# EAGLE design wssf_arduino_nano_server (EAGLE 9.6.2)
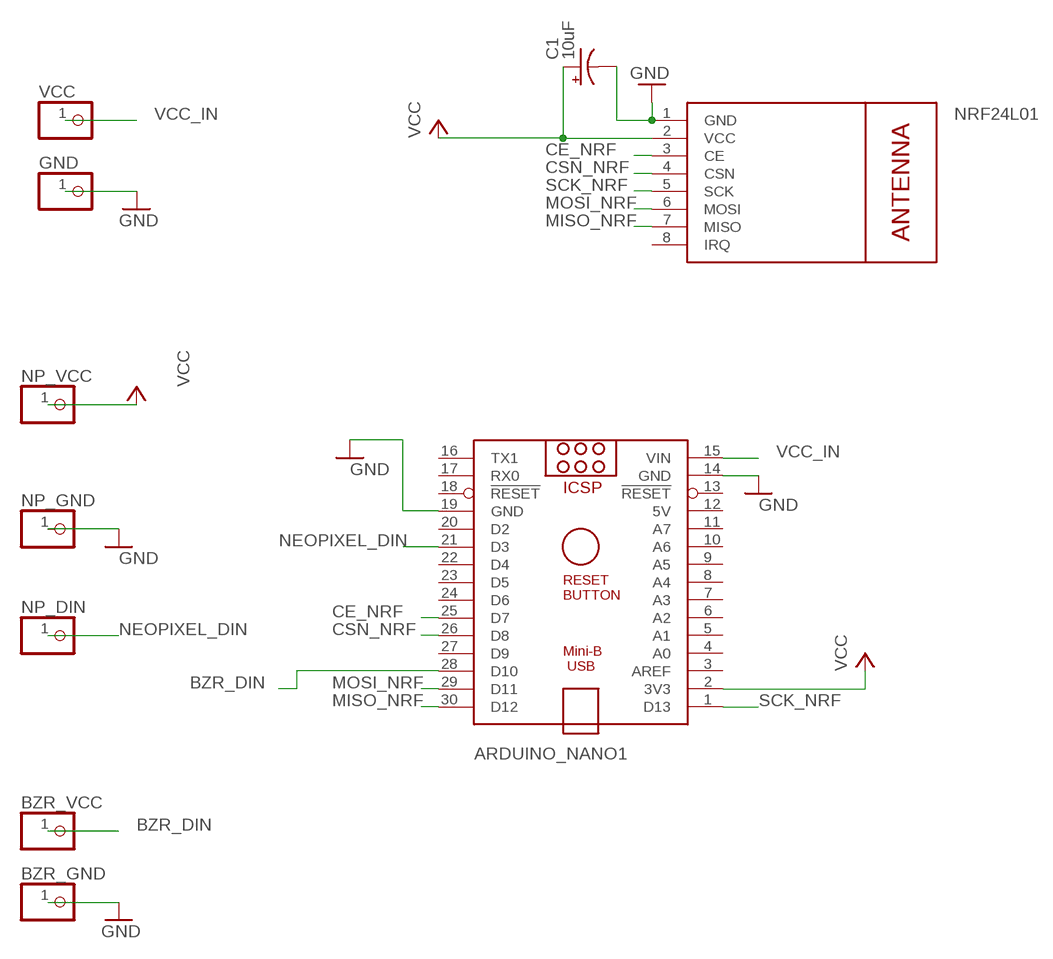
[diagram p0: schematic, sheet 1]

## Parts
ARDUINO_NANO1  ARDUINO_NANO  [ARDUINO_NANO]
BZR_GND  PINHD-1X1  [1X01]
BZR_VCC  PINHD-1X1  [1X01]
C1  10uF  CPOL-USE2-5  [E2-5]
GND  PINHD-1X1  [1X01]
NP_DIN  PINHD-1X1  [1X01]
NP_GND  PINHD-1X1  [1X01]
NP_VCC  PINHD-1X1  [1X01]
NRF24L01  WIRELESS-NRF24L01  [WIRELESS-NRF24L01]
VCC  PINHD-1X1  [1X01]

## Nets
BZR_DIN: ARDUINO_NANO1.28(D10) BZR_VCC.1
CE_NRF: ARDUINO_NANO1.25(D7) NRF24L01.3(CE)
CSN_NRF: ARDUINO_NANO1.26(D8) NRF24L01.4(CSN)
GND: ARDUINO_NANO1.14(GND) ARDUINO_NANO1.19(GND) BZR_GND.1 C1.- GND.1 NP_GND.1 NRF24L01.1(GND)
MISO_NRF: ARDUINO_NANO1.30(D12) NRF24L01.7(MISO)
MOSI_NRF: ARDUINO_NANO1.29(D11) NRF24L01.6(MOSI)
NEOPIXEL_DIN: ARDUINO_NANO1.21(D3) NP_DIN.1
SCK_NRF: ARDUINO_NANO1.1(D13) NRF24L01.5(SCK)
VCC: ARDUINO_NANO1.2(3V3) C1.+ NP_VCC.1 NRF24L01.2(VCC)
VCC_IN: ARDUINO_NANO1.15(VIN) VCC.1
Unconnected: ARDUINO_NANO1.3(AREF) ARDUINO_NANO1.4(A0) ARDUINO_NANO1.5(A1) ARDUINO_NANO1.6(A2) ARDUINO_NANO1.7(A3) ARDUINO_NANO1.8(A4) ARDUINO_NANO1.9(A5) ARDUINO_NANO1.10(A6) ARDUINO_NANO1.11(A7) ARDUINO_NANO1.13(!RESET) ARDUINO_NANO1.16(TX1) ARDUINO_NANO1.17(RX0) ARDUINO_NANO1.18(!RESET) ARDUINO_NANO1.20(D2) ARDUINO_NANO1.22(D4) ARDUINO_NANO1.23(D5) ARDUINO_NANO1.24(D6) ARDUINO_NANO1.27(D9) NRF24L01.8(IRQ)

## Power pins joined to a net without a drawn wire
5V: ARDUINO_NANO1.12(5V)

## Library data of the parts
ARDUINO_NANO1 = ArduinoNanoV30:ARDUINO_NANO: Arduino Nano V3.0 Overview: The Arduino Nano is a small, complete, and breadboard-friendly board based on the ATmega328 (Arduino Nano 3.x) or ATmega168 (Arduino Nano 2.x). It has more or less the same functionality of the Arduino Duemilanove, but in a different package. It lacks only a DC power jack, and works with a Mini-B USB cable instead of a standard one. The Nano was designed and is being produced by Gravitech. Specifications: Microcontroller Atmel ATmega168 or ATmega328 Operating Voltage (logic level) 5 V Input Voltage (recommended) 7-12 V Input Voltage (limits) 6-20 V Digital I/O Pins 14 (of which 6 provide PWM output) Analog Input Pins 8 DC Current per I/O Pin 40 mA Flash Memory 16 KB (ATmega168) or 32 KB (ATmega328) of which 2 KB used by bootloader SRAM 1 KB (ATmega168) or 2 KB (ATmega328) EEPROM 512 bytes (ATmega168) or 1 KB (ATmega328) Clock Speed 16 MHz Dimensions 0.73" x 1.70" Length 45 mm Width 18 mm Weigth 5 g Power: The Arduino Nano can be powered via the Mini-B USB connection, 6-20V unregulated external power supply (pin 30), or 5V regulated external power supply (pin 27). The power source is automatically selected to the highest voltage source. Memory: The ATmega168 has 16 KB of flash memory for storing code (of which 2 KB is used for the bootloader); the ATmega328 has 32 KB, (also with 2 KB used for the bootloader). The ATmega168 has 1 KB of SRAM and 512 bytes of EEPROM (which can be read and written with the EEPROM library); the ATmega328 has 2 KB of SRAM and 1 KB of EEPROM. Input and Output: Each of the 14 digital pins on the Nano can be used as an input or output, using pinMode(), digitalWrite(), and digitalRead() functions. They operate at 5 volts. Each pin can provide or receive a maximum of 40 mA and has an internal pull-up resistor (disconnected by default) of 20-50 kOhms. In addition, some pins have specialized functions. Visit Arduino - ArduinoBoardNano <https://www.arduino.cc/en/Main/ArduinoBoardNano>
BZR_GND BZR_VCC GND NP_DIN NP_GND NP_VCC VCC = pinhead:PINHD-1X1: PIN HEADER
C1 = rcl:CPOL-US: POLARIZED CAPACITOR, American symbol; SPICEPREFIX: C
NRF24L01 = diy-modules:WIRELESS-NRF24L01: 2.4 GHz Wireless Module based on NRF24L01 chip More details available here: http://www.electrodragon.com/w/NRF24L01 Click here to find device on ebay.com <http://www.ebay.com/sch/nrf24l01+arduino>

## Board
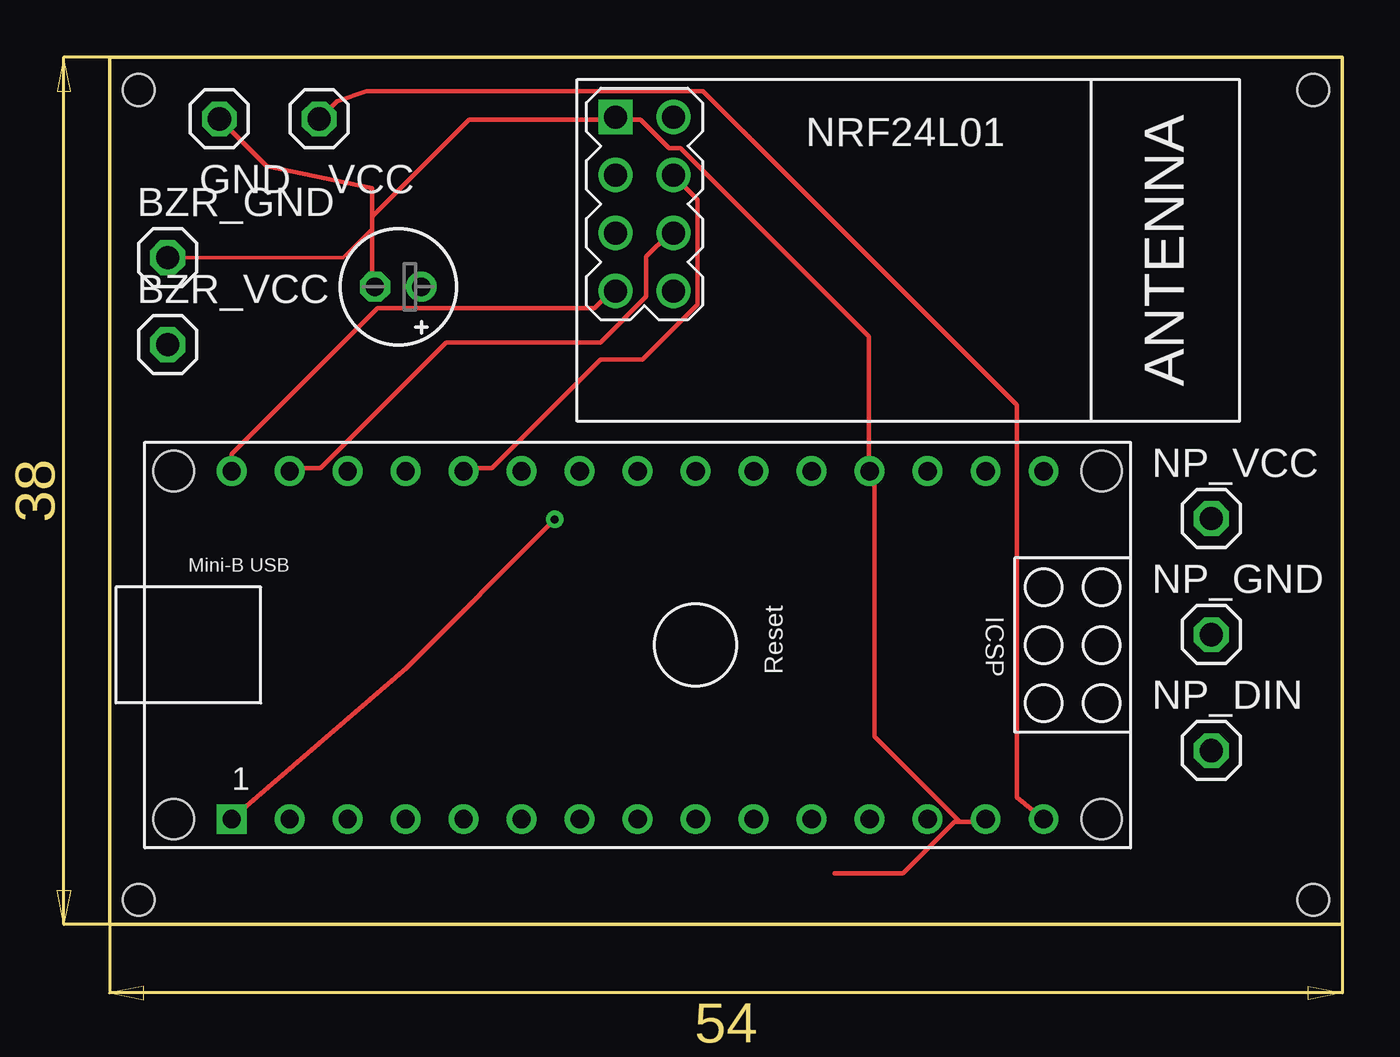
[diagram p1: board, top side]
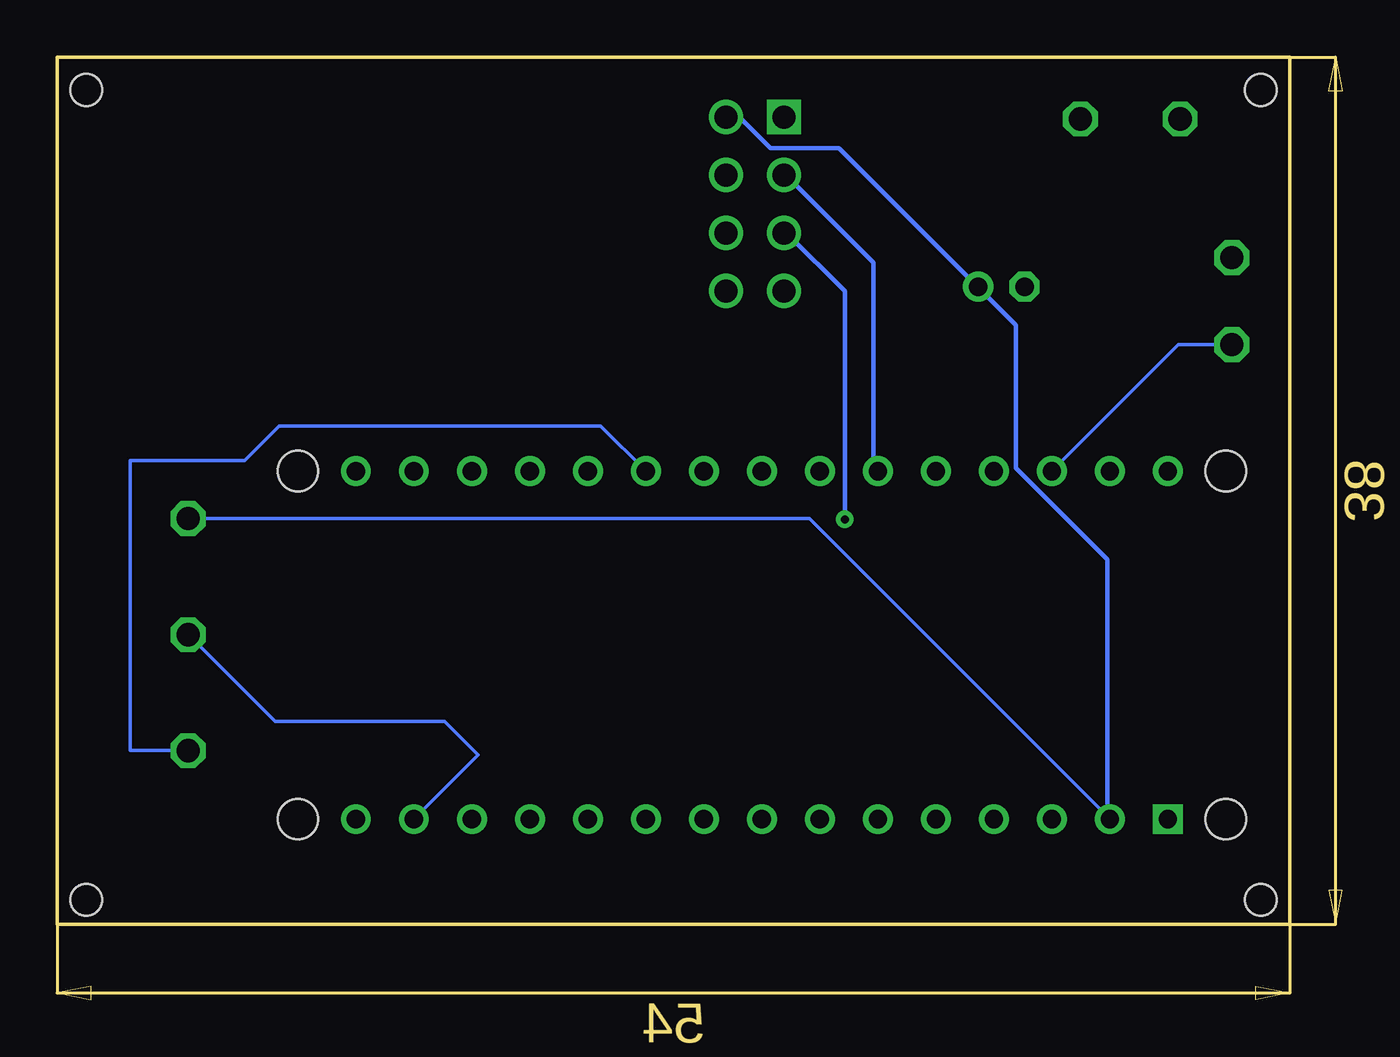
[diagram p2: board, bottom side, seen from below]

Size 54 x 38 mm. Coordinates in mm from the lower left corner, seen from the top.
Outline: 0,0 0,38 54,38 54,0 0,0
Copper layers (1*16): Top 0.035mm / dielectric 1.5mm / Bottom 0.035mm
Design rules "default": minimum track width 6mil, minimum drill 0.35mm, track to track 6mil, track to pad 6mil, pad to pad 6mil, via to via 6mil, smd to smd 6mil, copper to edge 40mil, drill to drill 6mil, minimum pad ring 10mil, minimum via ring 8mil, stop-mask expansion 4mil, vias tented up to drill 0mil, thermal gap 10mil
Holes 1.4 mm at 52.72,36.56 1.27,1.08 1.27,36.56 52.72,1.08

### Footprints (pad centres in the part's own frame; a part is rotated, then mirrored left to right if it is on the bottom)
ARDUINO_NANO = drill 0.8 square: 1 -20.32,-7.62 | drill 0.8: 2 -17.78,-7.62; 3 -15.24,-7.62; 4 -12.7,-7.62; 5 -10.16,-7.62; 6 -7.62,-7.62; 7 -5.08,-7.62; 8 -2.54,-7.62; 9 0,-7.62; 10 2.54,-7.62; 11 5.08,-7.62; 12 7.62,-7.62; 13 10.16,-7.62; 14 12.7,-7.62; 15 15.24,-7.62; 16 15.24,7.62; 17 12.7,7.62; 18 10.16,7.62; 19 7.62,7.62; 20 5.08,7.62; 21 2.54,7.62; 22 0,7.62; 23 -2.54,7.62; 24 -5.08,7.62; 25 -7.62,7.62; 26 -10.16,7.62; 27 -12.7,7.62; 28 -15.24,7.62; 29 -17.78,7.62; 30 -20.32,7.62 | hole 1.778: -22.86,-7.62; -22.86,7.62; 17.78,7.62; 17.78,-7.62
1X01 = drill 1.016 octagon: 1 0,0
E2-5 = drill 0.813 pad 1.27: + -1.016,0 | drill 0.813 pad 1.27 octagon: - 1.016,0
WIRELESS-NRF24L01 = drill 1 square: 1 -12.7,6.35 | drill 1: 2 -10.16,6.35; 3 -12.7,3.81; 4 -10.16,3.81; 5 -12.7,1.27; 6 -10.16,1.27; 7 -12.7,-1.27; 8 -10.16,-1.27

### Placement (x,y rotation side)
ARDUINO_NANO1  25.67,12.24 0 top
BZR_GND  2.54,29.21 0 top
BZR_VCC  2.54,25.4 0 top
C1  12.64,27.94 180 top
GND  4.81,35.29 0 top
NP_DIN  48.26,7.62 0 top
NP_GND  48.26,12.7 0 top
NP_VCC  48.26,17.78 0 top
NRF24L01  34.86,29.02 0 top
VCC  9.18,35.29 0 top

### Tracks (layer width: path | path; a pad name or v marks a point on that pad's centre or on a via)
BZR_DIN
  Bottom 0.152: ARDUINO_NANO1.28 4.89,25.4 BZR_VCC.1
CE_NRF
  Bottom 0.2: ARDUINO_NANO1.25 18.25,20 18.25,29 22,32.75 NRF24L01.3
CSN_NRF
  Top 0.2: ARDUINO_NANO1.26 15.75,20 16.75,20 21.5,24.75 23.33,24.75 25.75,27.17 25.75,31.75 24.75,32.75 NRF24L01.4
GND
  Top 0.152: 11.5,30.48 10.23,29.21 BZR_GND.1
  Top 0.2: 11.5,31 11.5,32.25 6.88,33.22 GND.1 | 11.5,31 11.5,30.48 11.5,28 C1.- | 11.5,31 15.75,35.25 22,35.25 NRF24L01.1 22.25,35.25 23.25,35.25 24.5,34 25,34 33.25,25.75 33.25,20 ARDUINO_NANO1.19 33.5,19.75 33.5,8.25 37.25,4.5 | 37.25,4.5 37,4.5 34.75,2.25 31.75,2.25 | 37.25,4.5 38.25,4.5 ARDUINO_NANO1.14
  Bottom 0.152: NP_GND.1 44.45,8.89 37.02,8.89 35.56,7.43 ARDUINO_NANO1.14
MISO_NRF
  Top 0.2: ARDUINO_NANO1.30 5.35,20.6 11.75,27 21.25,27 22,27.75 NRF24L01.7
MOSI_NRF
  Top 0.2: ARDUINO_NANO1.29 8,20 9.25,20 14.75,25.5 21.5,25.5 23.5,27.5 23.5,29.25 24.5,30.25 NRF24L01.6
NEOPIXEL_DIN
  Bottom 0.152: NP_DIN.1 50.8,7.62 50.8,20.32 45.79,20.32 44.27,21.84 30.19,21.84 ARDUINO_NANO1.21
SCK_NRF  (via drill 0.35)
  Top 0.2: v19.5,17.75 13,11.25 ARDUINO_NANO1.1
  Bottom 0.2: v19.5,17.75 19.5,27.75 22,30.25 NRF24L01.5
VCC
  Bottom 0.152: ARDUINO_NANO1.2 21.05,17.78 NP_VCC.1
  Bottom 0.2: ARDUINO_NANO1.2 8,4.75 8,16 12,20 12,26.25 13.5,27.75 C1.+ 13.75,28 19.75,34 22.75,34 24,35.25 24.5,35.25 NRF24L01.2
VCC_IN
  Top 0.2: ARDUINO_NANO1.15 39.75,5.56 39.75,22.75 26,36.5 11.25,36.5 9.96,36.07 VCC.1